# Altium schematic sheet TITLE.SchDoc: TITLE
size A4; DocumentNumber: 1; SheetNumber: 1; SheetTotal: 19; DOC_NO_SCH_DWG: Title.SchDoc
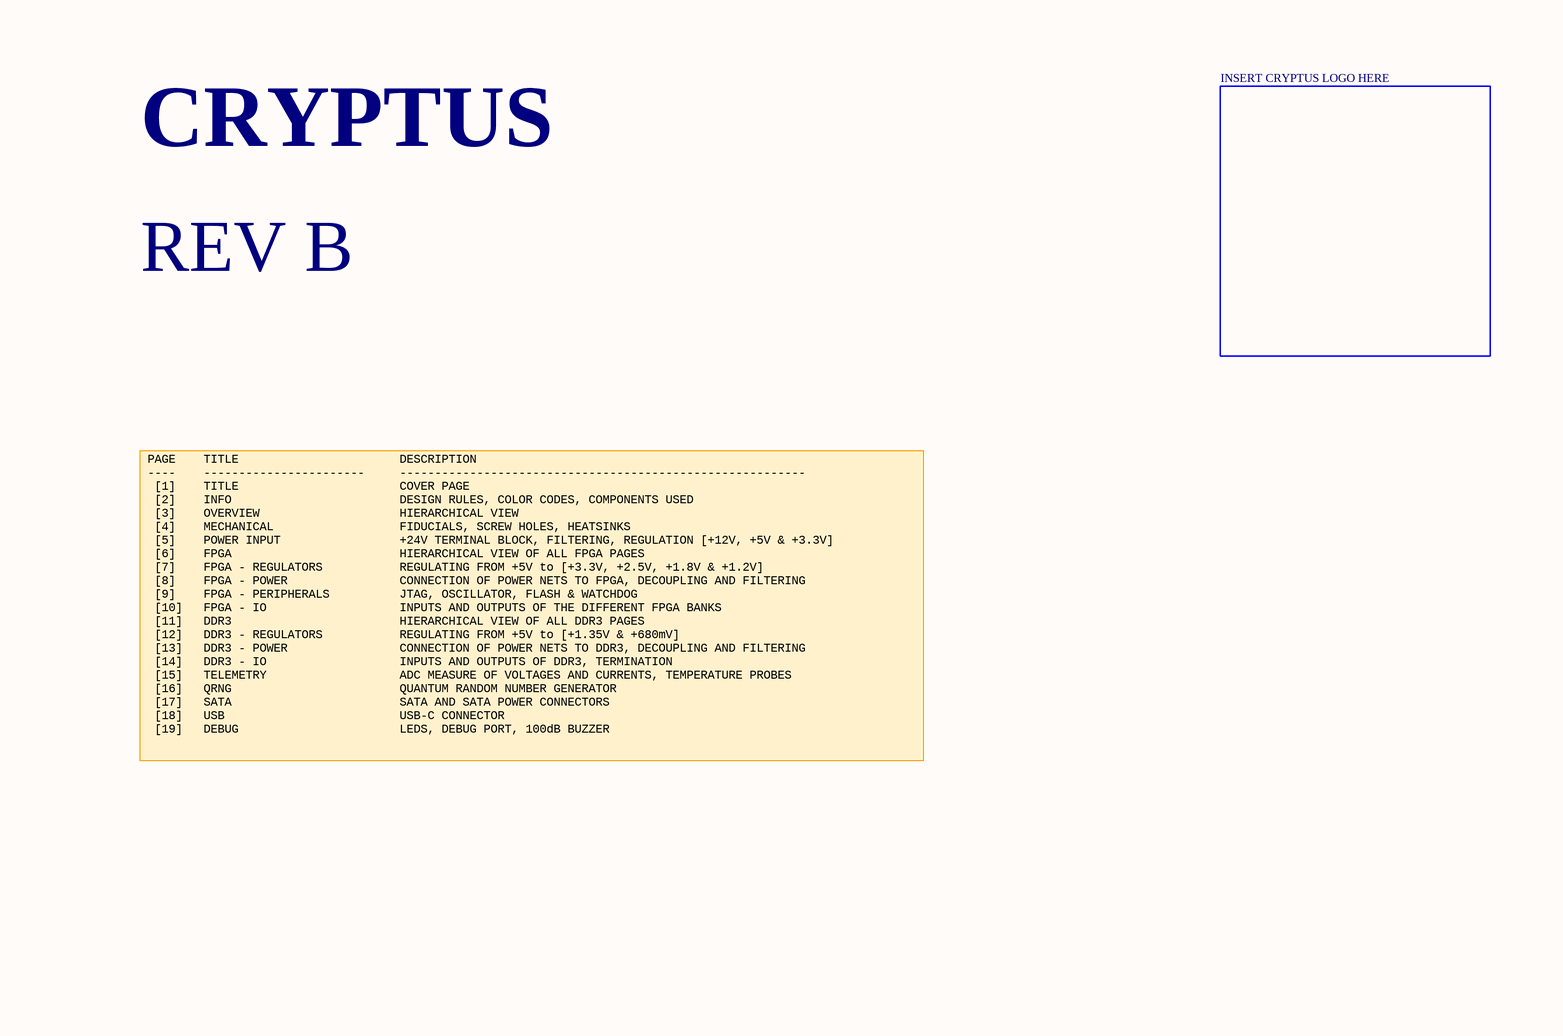
[diagram p0: TITLE.SchDoc]

## Sub-sheets
INFO PAGE = INFO.SchDoc: no entries
INSERT CRYPTUS LOGO HERE = OVERVIEW.SchDoc: no entries

## Notes on the sheet
- CRYPTUS
- REV B
- PAGE    TITLE                       DESCRIPTION
  ----    -----------------------     ----------------------------------------------------------
  [1]    TITLE                       COVER PAGE
  [2]    INFO                        DESIGN RULES, COLOR CODES, COMPONENTS USED
  [3]    OVERVIEW                    HIERARCHICAL VIEW
  [4]    MECHANICAL                  FIDUCIALS, SCREW HOLES, HEATSINKS
  [5]    POWER INPUT                 +24V TERMINAL BLOCK, FILTERING, REGULATION [+12V, +5V & +3.3V]
  [6]    FPGA                        HIERARCHICAL VIEW OF ALL FPGA PAGES
  [7]    FPGA - REGULATORS           REGULATING FROM +5V to [+3.3V, +2.5V, +1.8V & +1.2V]
  [8]    FPGA - POWER                CONNECTION OF POWER NETS TO FPGA, DECOUPLING AND FILTERING
  [9]    FPGA - PERIPHERALS          JTAG, OSCILLATOR, FLASH & WATCHDOG
  [10]   FPGA - IO                   INPUTS AND OUTPUTS OF THE DIFFERENT FPGA BANKS
  [11]   DDR3                        HIERARCHICAL VIEW OF ALL DDR3 PAGES
  [12]   DDR3 - REGULATORS           REGULATING FROM +5V to [+1.35V & +680mV]
  [13]   DDR3 - POWER                CONNECTION OF POWER NETS TO DDR3, DECOUPLING AND FILTERING
  [14]   DDR3 - IO                   INPUTS AND OUTPUTS OF DDR3, TERMINATION
  [15]   TELEMETRY                   ADC MEASURE OF VOLTAGES AND CURRENTS, TEMPERATURE PROBES
  [16]   QRNG                        QUANTUM RANDOM NUMBER GENERATOR
  [17]   SATA                        SATA AND SATA POWER CONNECTORS
  [18]   USB                         USB-C CONNECTOR
  [19]   DEBUG                       LEDS, DEBUG PORT, 100dB BUZZER
- THIS DOCUMENT AND THE DATA DISCLOSED HEREIN OR
- HEREWITH IS THE PROPERTY OF ALTIUM LIMITED AND MAY
- DWG NO:
- REVISION
- REV:
- DESCRIPTION
- DATE
- APPROVED
- BE FREELY DISTRIBUTED IN WHOLE. NO RIGHTS ARE
- RESERVED OR EXPRESS OR IMPLIED WARANTEE GIVEN.
- ENG:
- APPROVALS
- PROJECT
- DSN:
- CHK:
- REFERENCE DOCUMENTS
- PROJECT REVISION:
- TITLE
- DOCUMENT REVISION:
- DESIGN ITEM:
- BOM:
- FAB DWG:
- PCB DWG:
- ASSY DWG:
- SCALE:
- A3
- SIZE
- CAGE CODE
- FILE NAME
- DWG NO.
- SHEET
- OF
- REV